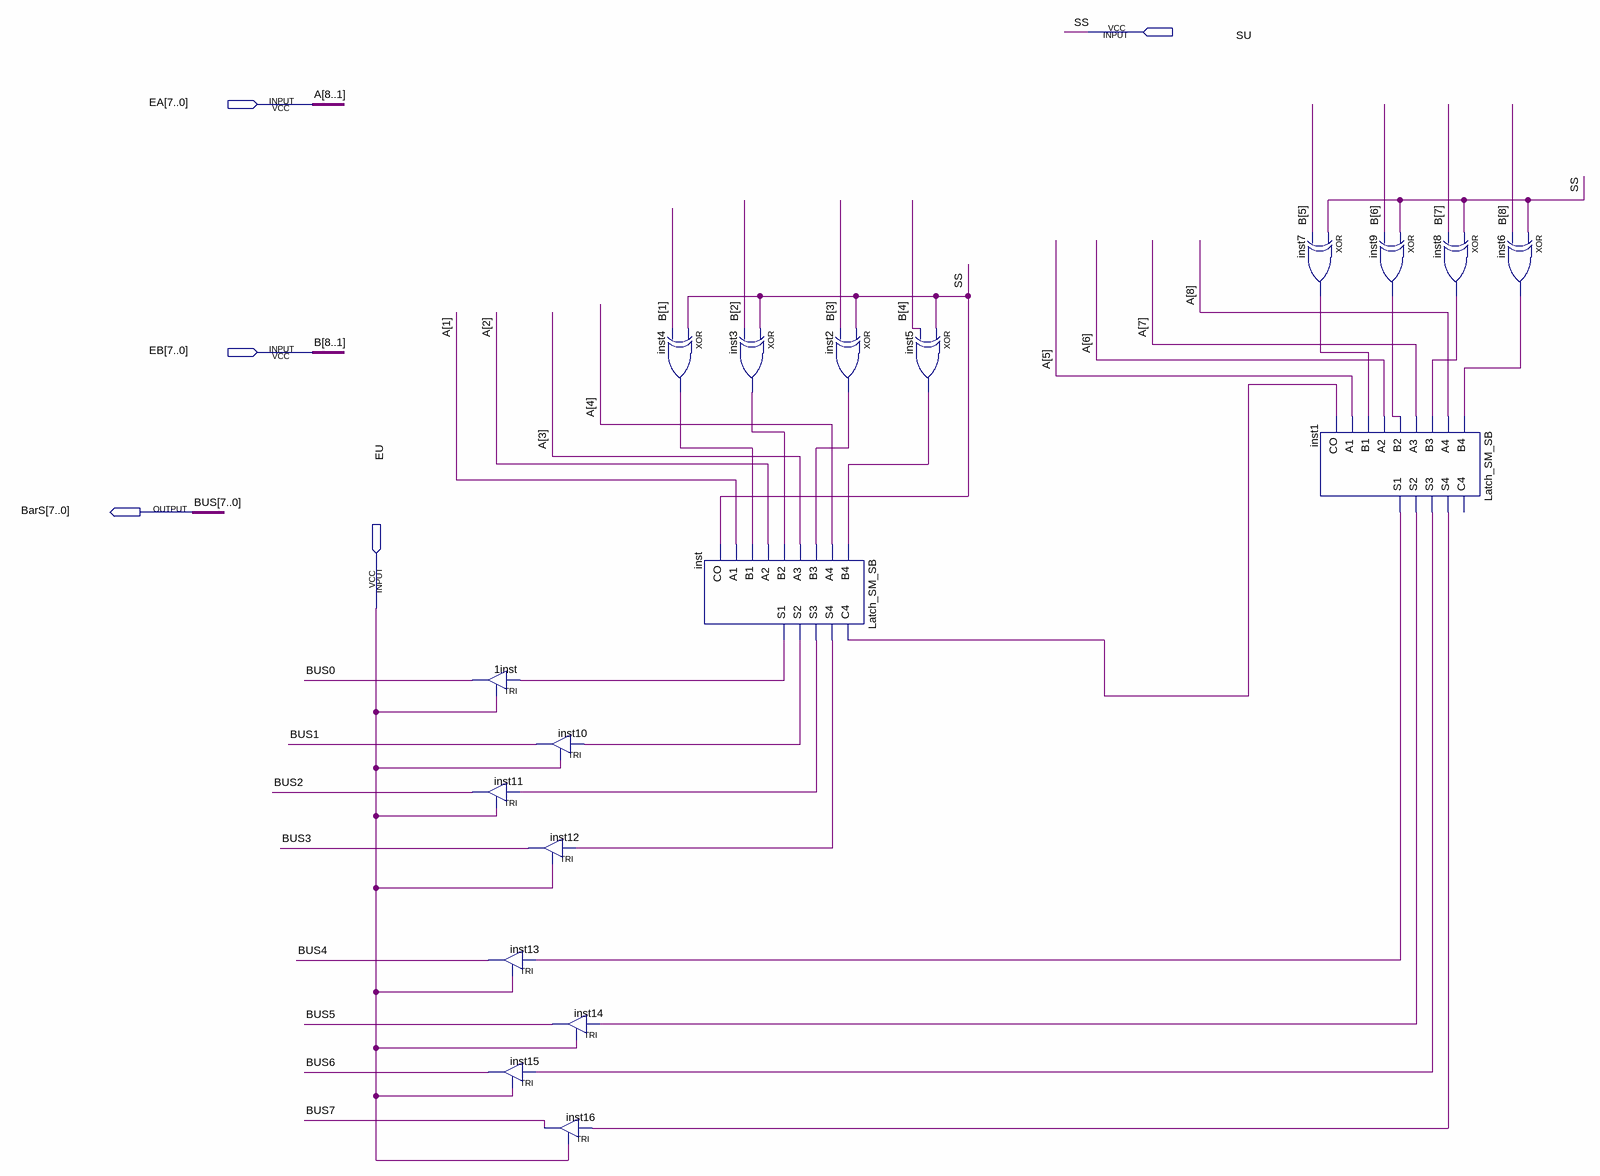
[diagram p0: schematic sheet]
// Quartus schematic Somador_Subtrator.bdf as structural Verilog: 18 symbols, 5 pins
module Somador_Subtrator (
  input  SU,
  input  [7:0] EA,
  input  [7:0] EB,
  input  EU,
  output [7:0] BarS
);

  wire inst1_s1, inst1_s2, inst1_s3, inst1_s4, inst2_out, inst3_out, inst4_out, inst5_out, inst6_out,
       inst7_out, inst8_out, inst9_out, inst_c4, inst_s1, inst_s2, inst_s3, inst_s4;

  TRI u_1inst (.IN(inst_s1), .OE(EU), .OUT(BarS[0]));
  TRI inst11 (.IN(inst_s3), .OE(EU), .OUT(BarS[2]));
  TRI inst12 (.IN(inst_s4), .OE(EU), .OUT(BarS[3]));
  TRI inst13 (.IN(inst1_s1), .OE(EU), .OUT(BarS[4]));
  TRI inst15 (.IN(inst1_s3), .OE(EU), .OUT(BarS[6]));
  TRI inst10 (.IN(inst_s2), .OE(EU), .OUT(BarS[1]));
  TRI inst14 (.IN(inst1_s2), .OE(EU), .OUT(BarS[5]));
  TRI inst16 (.IN(inst1_s4), .OE(EU), .OUT(BarS[7]));
  xor inst4 (inst4_out, SU, EB[0]);
  Latch_SM_SB inst (
    .B4(inst5_out), .A4(EA[3]), .B3(inst2_out), .A3(EA[2]), .B2(inst3_out), .A2(EA[1]), .B1(inst4_out),
    .A1(EA[0]), .CO(SU), .C4(inst_c4), .S4(inst_s4), .S3(inst_s3), .S2(inst_s2), .S1(inst_s1));
  xor inst3 (inst3_out, SU, EB[1]);
  xor inst2 (inst2_out, SU, EB[2]);
  xor inst5 (inst5_out, SU, EB[3]);
  xor inst7 (inst7_out, SU, EB[4]);
  Latch_SM_SB inst1 (
    .B4(inst6_out), .A4(EA[7]), .B3(inst8_out), .A3(EA[6]), .B2(inst9_out), .A2(EA[5]), .B1(inst7_out),
    .A1(EA[4]), .CO(inst_c4), .S4(inst1_s4), .S3(inst1_s3), .S2(inst1_s2), .S1(inst1_s1));  // open: C4
  xor inst9 (inst9_out, SU, EB[5]);
  xor inst8 (inst8_out, SU, EB[6]);
  xor inst6 (inst6_out, SU, EB[7]);

  // Other names for the same wires on the sheet: A[8:1] = EA; B[8:1] = EB; BUS[7:0] = BarS; BUS0 = BarS[0];
  //   BUS1 = BarS[1]; BUS2 = BarS[2]; BUS3 = BarS[3]; BUS4 = BarS[4]; BUS5 = BarS[5]; BUS6 = BarS[6]; BUS7 = BarS[7];
  //   SS = SU
endmodule
